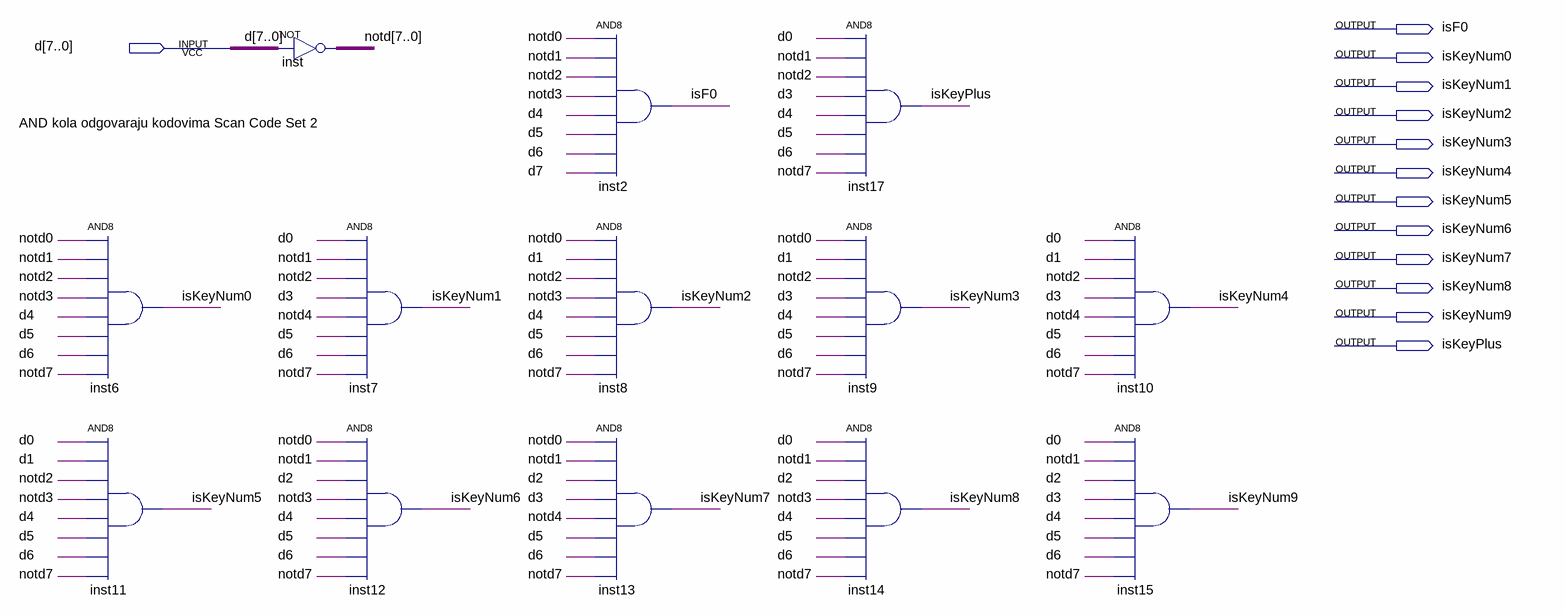
[diagram p0: schematic sheet]
// Quartus schematic KeyDetector.bdf as structural Verilog: 13 symbols, 13 pins
module KeyDetector (
  input  [7:0] d,
  output isF0,
  output isKeyNum0,
  output isKeyNum1,
  output isKeyNum2,
  output isKeyNum3,
  output isKeyNum4,
  output isKeyNum5,
  output isKeyNum6,
  output isKeyNum7,
  output isKeyNum8,
  output isKeyNum9,
  output isKeyPlus
);

  wire [7:0] notd;

  and inst6 (isKeyNum0, notd[0], notd[1], notd[2], notd[3], d[4], d[5], d[6], notd[7]);
  and inst11 (isKeyNum5, d[0], d[1], notd[2], notd[3], d[4], d[5], d[6], notd[7]);
  assign notd = ~d;  // NOT inst, 8 bits wide
  and inst7 (isKeyNum1, d[0], notd[1], notd[2], d[3], notd[4], d[5], d[6], notd[7]);
  and inst12 (isKeyNum6, notd[0], notd[1], d[2], notd[3], d[4], d[5], d[6], notd[7]);
  and inst2 (isF0, notd[0], notd[1], notd[2], notd[3], d[4], d[5], d[6], d[7]);
  and inst8 (isKeyNum2, notd[0], d[1], notd[2], notd[3], d[4], d[5], d[6], notd[7]);
  and inst13 (isKeyNum7, notd[0], notd[1], d[2], d[3], notd[4], d[5], d[6], notd[7]);
  and inst17 (isKeyPlus, d[0], notd[1], notd[2], d[3], d[4], d[5], d[6], notd[7]);
  and inst9 (isKeyNum3, notd[0], d[1], notd[2], d[3], d[4], d[5], d[6], notd[7]);
  and inst14 (isKeyNum8, d[0], notd[1], d[2], notd[3], d[4], d[5], d[6], notd[7]);
  and inst10 (isKeyNum4, d[0], d[1], notd[2], d[3], notd[4], d[5], d[6], notd[7]);
  and inst15 (isKeyNum9, d[0], notd[1], d[2], d[3], d[4], d[5], d[6], notd[7]);

  // Notes on the sheet:
  //   AND kola odgovaraju kodovima Scan Code Set 2
endmodule
